# EasyEDA Pro project ProProject_消毒盒3.0_传统版_2023-10-16.epro

# Schematic 消毒盒3.0
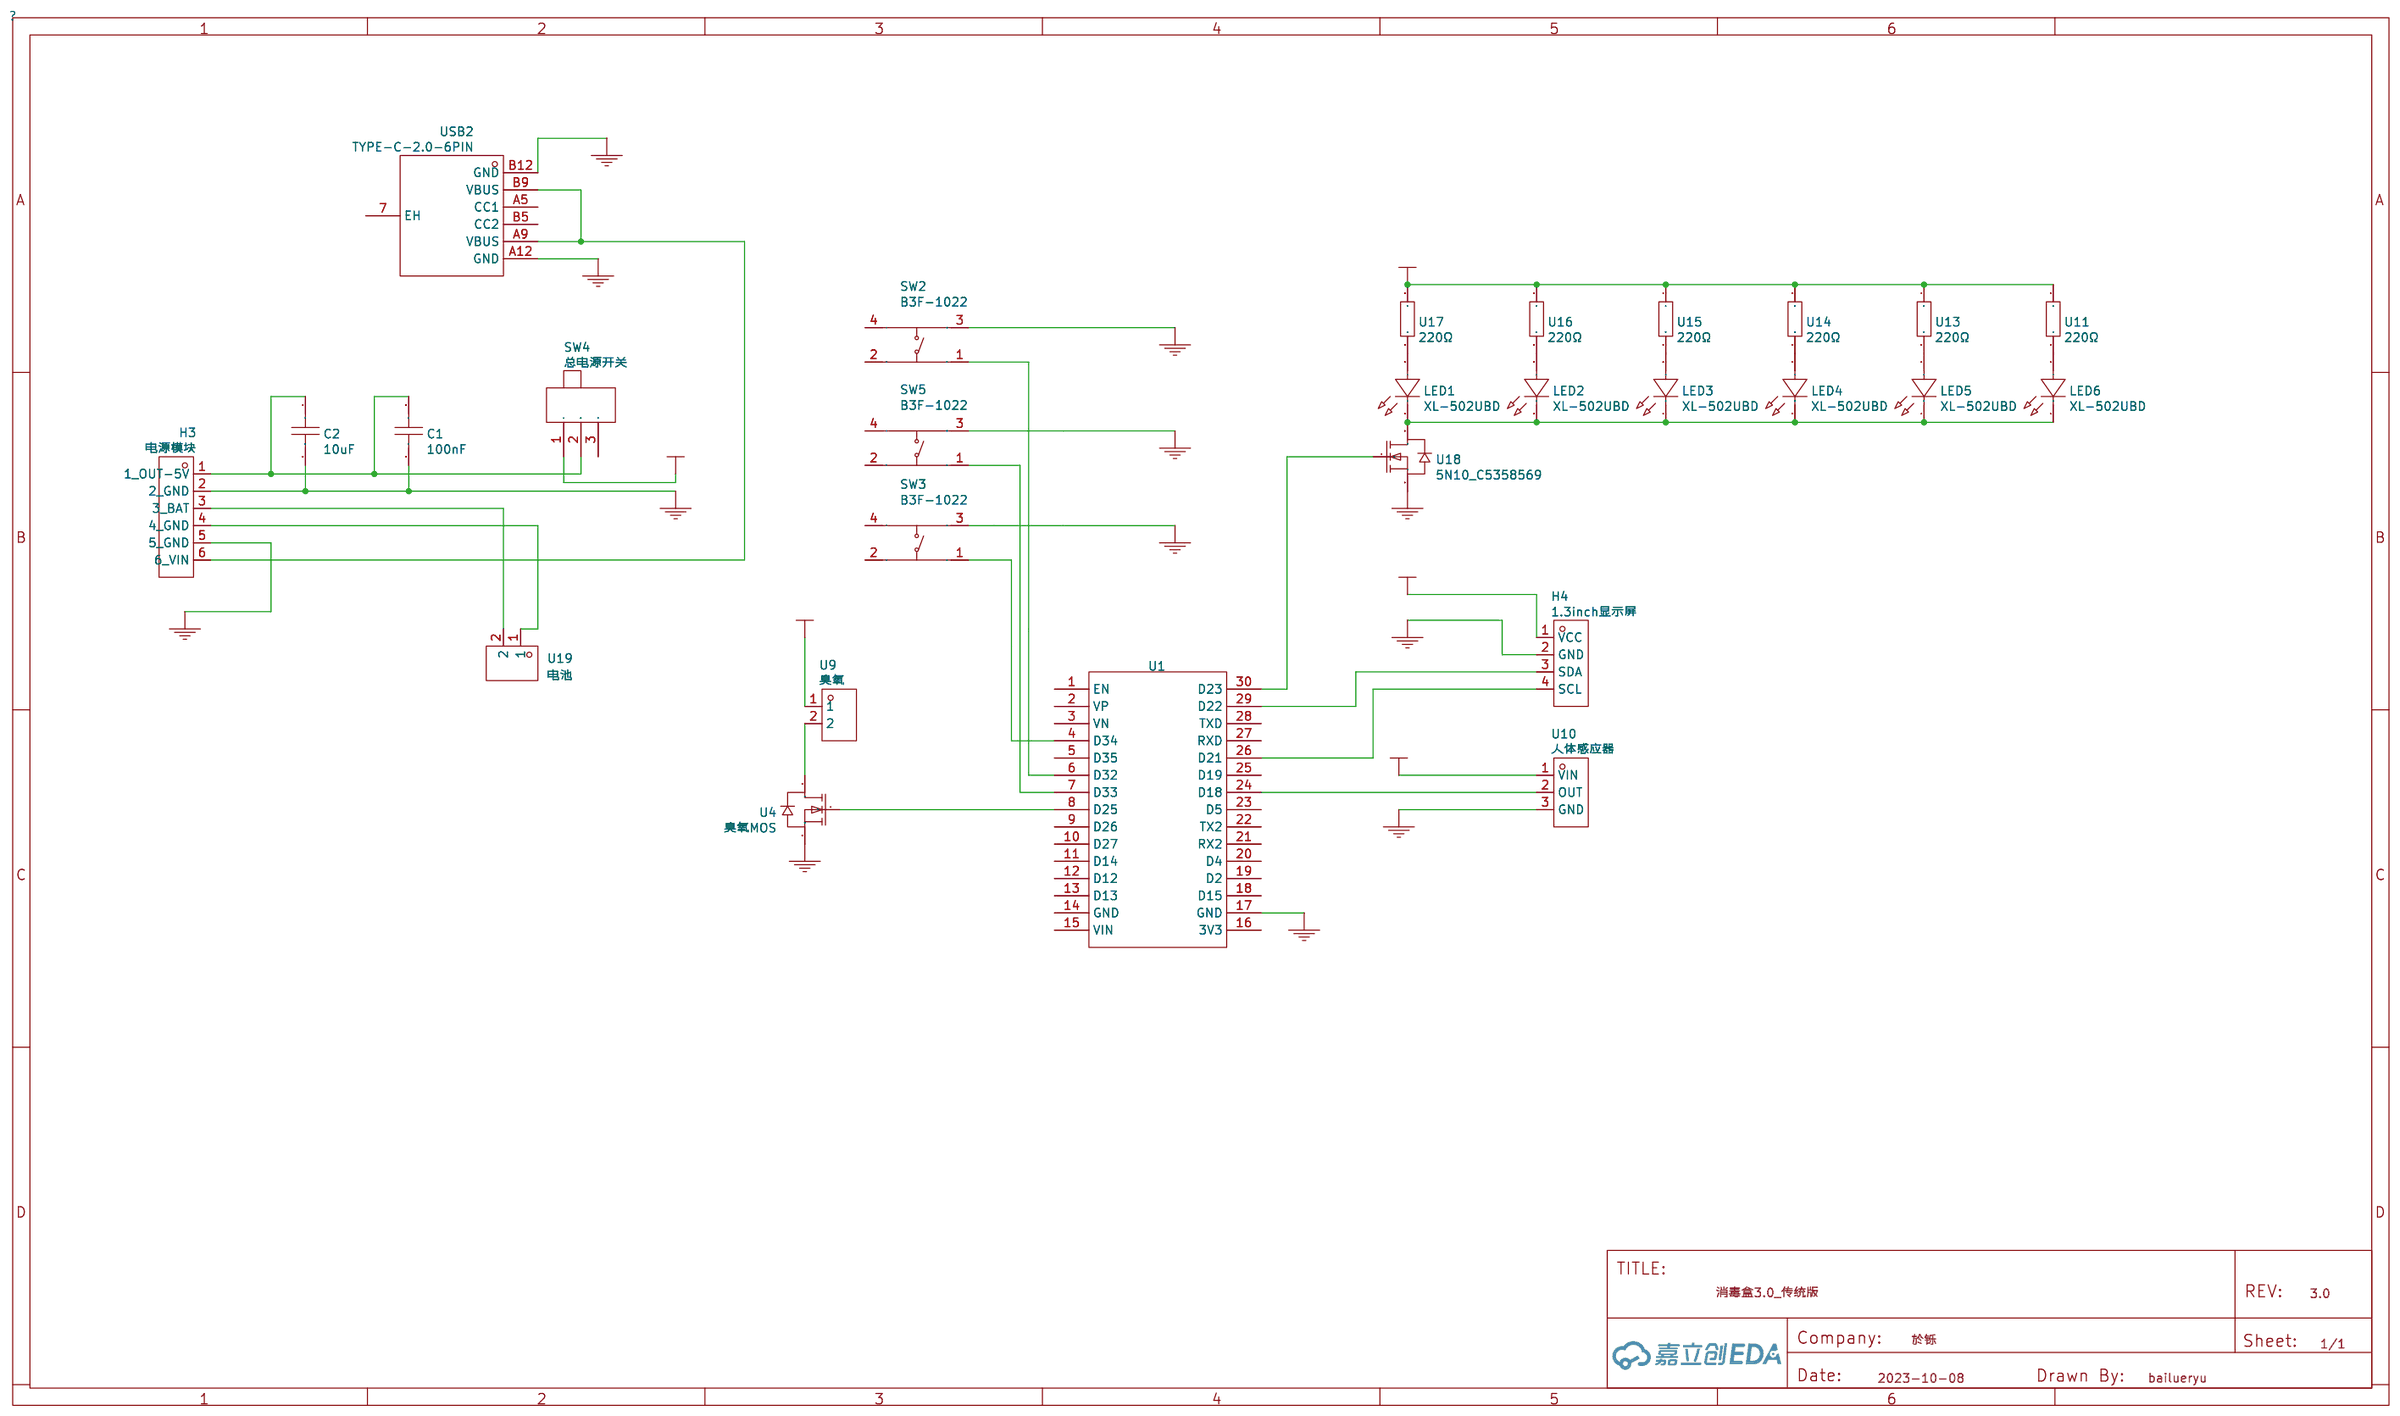
[diagram p0: schematic sheet]

## Parts
C1  100nF  [C0603]
C2  10uF  [C0603]
H3  电源模块  [HDR-TH_6P-P2.54-V-M]
H4  1.3inch显示屏  [HDR-TH_4P-P2.54-V-M]
LED1  XL-502UBD  [LED-TH_BD5.9-P2.54-RD_BLUE]
LED2  XL-502UBD  [LED-TH_BD5.9-P2.54-RD_BLUE]
LED3  XL-502UBD  [LED-TH_BD5.9-P2.54-RD_BLUE]
LED4  XL-502UBD  [LED-TH_BD5.9-P2.54-RD_BLUE]
LED5  XL-502UBD  [LED-TH_BD5.9-P2.54-RD_BLUE]
LED6  XL-502UBD  [LED-TH_BD5.9-P2.54-RD_BLUE]
SW2  B3F-1022  [SW-TH_4P-L6.0-W6.0-P4.50-LS6.5]
SW3  B3F-1022  [SW-TH_4P-L6.0-W6.0-P4.50-LS6.5]
SW4  总电源开关  [SW-TH_MK-12D18-G040]
SW5  B3F-1022  [SW-TH_4P-L6.0-W6.0-P4.50-LS6.5]
U1  NO  [ESP-WROOM-32]
U4  臭氧MOS  [SOT-23-3_L2.9-W1.3-P1.90-LS2.4-BR]
U9  臭氧  [HDR-TH_2P-P2.00-V-M]
U10  人体感应器  [HDR-TH_3P-P2.00-V-M]
U11  220Ω  [RES-TH_BD2.3-L3.7-P7.70-D0.9]
U13  220Ω  [RES-TH_BD2.3-L3.7-P7.70-D0.9]
U14  220Ω  [RES-TH_BD2.3-L3.7-P7.70-D0.9]
U15  220Ω  [RES-TH_BD2.3-L3.7-P7.70-D0.9]
U16  220Ω  [RES-TH_BD2.3-L3.7-P7.70-D0.9]
U17  220Ω  [RES-TH_BD2.3-L3.7-P7.70-D0.9]
U18  5N10_C5358569  [SOT-23-3_L2.9-W1.3-P1.90-LS2.4-BR]
U19  电池  [HDR-TH_2P-P2.00-V-M]
USB2  TYPE-C-2.0-6PIN  [TYPE-C-SMD_TYPE-C-6P-2]

## Library data of the parts
C1 = 100nF: link: https://so.szlcsc.com/global.html?k=C3152610&amp;ref=editor; 3DModel: C0603_L1.6-W0.8-H0.8; Supplier: LCSC; Supplier Part: C3152610; Manufacturer: Sunway(信维通信); Manufacturer Part: MC0603B104K500N8RH; JLCPCB Part Class: Extended Part
C2 = 10uF: link: https://so.szlcsc.com/global.html?k=C15415&amp;ref=editor; 3DModel: C0603_L1.6-W0.8-H0.8; Supplier: LCSC; Supplier Part: C15415; Manufacturer: SAMSUNG(三星); JLCPCB Part Class: Extended Part
H3 = 电源模块: link: https://so.szlcsc.com/global.html?k=C492405&amp;ref=editor; 3DModel: HDR-TH_6P-P2.54-M-LI-1X6P; Supplier: LCSC; Supplier Part: C492405; Manufacturer: XFCN(兴飞); Manufacturer Part: PZ254V-11-06P; JLCPCB Part Class: Extended Part
H4 = 1.3inch显示屏: link: https://so.szlcsc.com/global.html?k=C2905435&amp;ref=editor; 3DModel: HDR-TH_4P-P2.54-M-LI-1X4P; Supplier: LCSC; Supplier Part: C2905435; Manufacturer: kinghelm(金航标); Manufacturer Part: KH-2.54PH180-1X4P-L11.5; JLCPCB Part Class: Extended Part
LED1-LED6 = XL-502UBD: link: https://so.szlcsc.com/global.html?k=C2895496&amp;ref=editor; Supplier: LCSC; Supplier Part: C2895496; Manufacturer: XINGLIGHT(成兴光); JLCPCB Part Class: Extended Part
SW2 SW3 SW5 = B3F-1022: link: https://so.szlcsc.com/global.html?k=C231317&amp;ref=editor; 3DModel: SW-TH_4P-L6.0-W6.0-H5.0-LS6.5-P4.50; Supplier: LCSC; Supplier Part: C231317; Manufacturer: OMRON(欧姆龙); JLCPCB Part Class: Extended Part
SW4 = 总电源开关: link: https://so.szlcsc.com/global.html?k=C3019727&amp;ref=editor; Supplier: LCSC; Supplier Part: C3019727; Manufacturer: G-Switch(品赞); Manufacturer Part: MK-12D18-G020; JLCPCB Part Class: Extended Part
U1 = NO
U4 = 臭氧MOS: link: https://so.szlcsc.com/global.html?k=C5358569&amp;ref=editor; 3DModel: SOT-23-3P_L2.9-W1.3-H1.0-LS2.4-P0.95; Supplier: LCSC; Supplier Part: C5358569; Manufacturer: GOODWORK(固得沃克); Manufacturer Part: 5N10
U9 U19 = 臭氧: link: https://so.szlcsc.com/global.html?k=C18164974&amp;ref=editor; 3DModel: HDR-TH_2P-P2.00-M-LI-1X2P; Supplier: LCSC; Supplier Part: C18164974; Manufacturer: CONNFLY; Manufacturer Part: DS1025-01-1x2P8BV1-B
U10 = 人体感应器: link: https://so.szlcsc.com/global.html?k=C18164975&amp;ref=editor; 3DModel: HDR-TH_3P-P2.00-M-LI-1X3P; Supplier: LCSC; Supplier Part: C18164975; Manufacturer: CONNFLY; Manufacturer Part: DS1025-01-1x3P8BV1-B
U11 U13-U17 = 220Ω: link: https://so.szlcsc.com/global.html?k=C2848572&amp;ref=editor; 3DModel: RES-TH_BD2.3-L3.7-P7.62-D0.4; Supplier: LCSC; Supplier Part: C2848572; Manufacturer: VO(翔胜); Manufacturer Part: MF1/8W-220Ω±1%-ST52; JLCPCB Part Class: Extended Part
U18 = 5N10_C5358569: link: https://so.szlcsc.com/global.html?k=C5358569&amp;ref=editor; 3DModel: SOT-23-3P_L2.9-W1.3-H1.0-LS2.4-P0.95; Supplier: LCSC; Supplier Part: C5358569; Manufacturer: GOODWORK(固得沃克); Manufacturer Part: 5N10
USB2 = TYPE-C-2.0-6PIN: link: https://so.szlcsc.com/global.html?k=C2987385&amp;ref=editor; Supplier: LCSC; Supplier Part: C2987385; Manufacturer: CIKI(皓富); Manufacturer Part: Type-C-2.0-6Pin; JLCPCB Part Class: Extended Part

## Nets
GND: C1.1 C2.2 H3.2(2 GND) H3.5(5 GND) H4.2(GND) SW2.3 SW3.3 SW5.3 U1.17(GND) U4.2(S) U10.3(GND) U18.2(S) USB2.A12(GND) USB2.B12(GND)
VCC: H4.1(VCC) SW4.1 U9.1 U10.1(VIN) U11.1 U13.1 U14.1 U15.1 U16.1 U17.1
$1N112: U1.8(D25) U4.1(G)
$1N404: LED1.1(K) LED2.1(K) LED3.1(K) LED4.1(K) LED5.1(K) LED6.1(K) U18.3(D)
$1N605: U1.30(D23) U18.1(G)
$1N699: SW2.1 U1.6(D32)
$1N700: SW5.1 U1.7(D33)
$1N701: SW3.1 U1.4(D34)
Net-(C1-2): C1.2 C2.1 H3.1(1 OUT-5V) SW4.2
Net-(H3-3): H3.3(3 BAT) U19.2
Net-(H3-4): H3.4(4 GND) U19.1
Net-(H3-6): H3.6(6 VIN) USB2.A9(VBUS) USB2.B9(VBUS)
Net-(H4-3): H4.3(SDA) U1.29(D22)
Net-(H4-4): H4.4(SCL) U1.26(D21)
Net-(LED1-2): LED1.2(A) U17.2
Net-(LED2-2): LED2.2(A) U16.2
Net-(LED3-2): LED3.2(A) U15.2
Net-(LED4-2): LED4.2(A) U14.2
Net-(LED5-2): LED5.2(A) U13.2
Net-(LED6-2): LED6.2(A) U11.2
Net-(U1-24): U1.24(D18) U10.2(OUT)
Net-(U4-3): U4.3(D) U9.2

Not connected (* = marked no-connect by the designer): SW2 2 4; SW3 2 4; SW4 3; SW5 2 4; U1 1(EN) 2(VP) 3(VN) 5(D35) 9(D26) 10(D27) 11(D14) 12(D12) 13(D13) 14(GND) 15(VIN) 16(3V3) 18(D15) 19(D2) 20(D4) 21(RX2) 22(TX2) 23(D5) 25(D19) 27(RXD) 28(TXD); USB2 7(EH) A5(CC1) B5(CC2)

# Board PCB_PCB_消毒盒3.0_2023-10-11
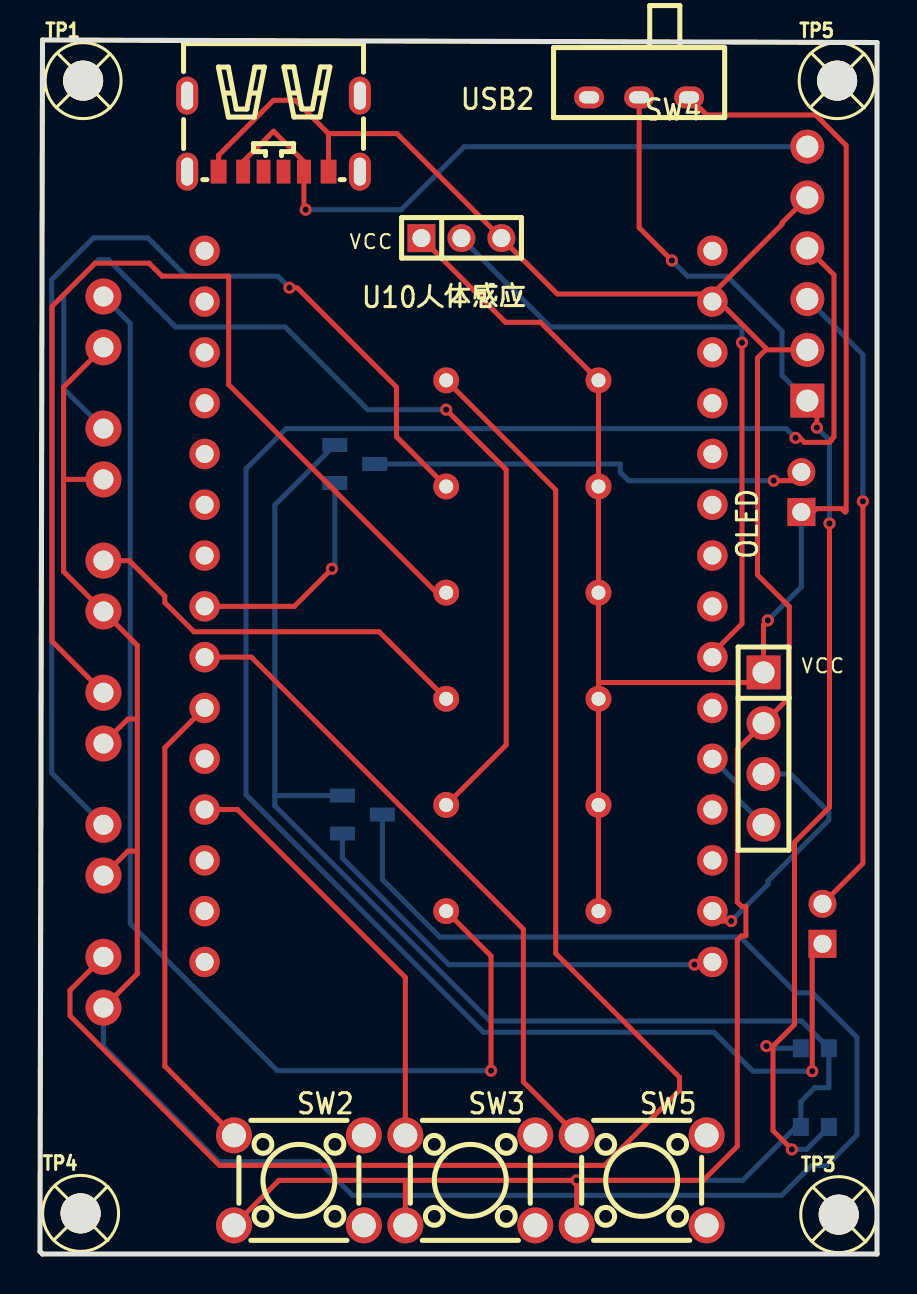
[diagram p1: board, top side]
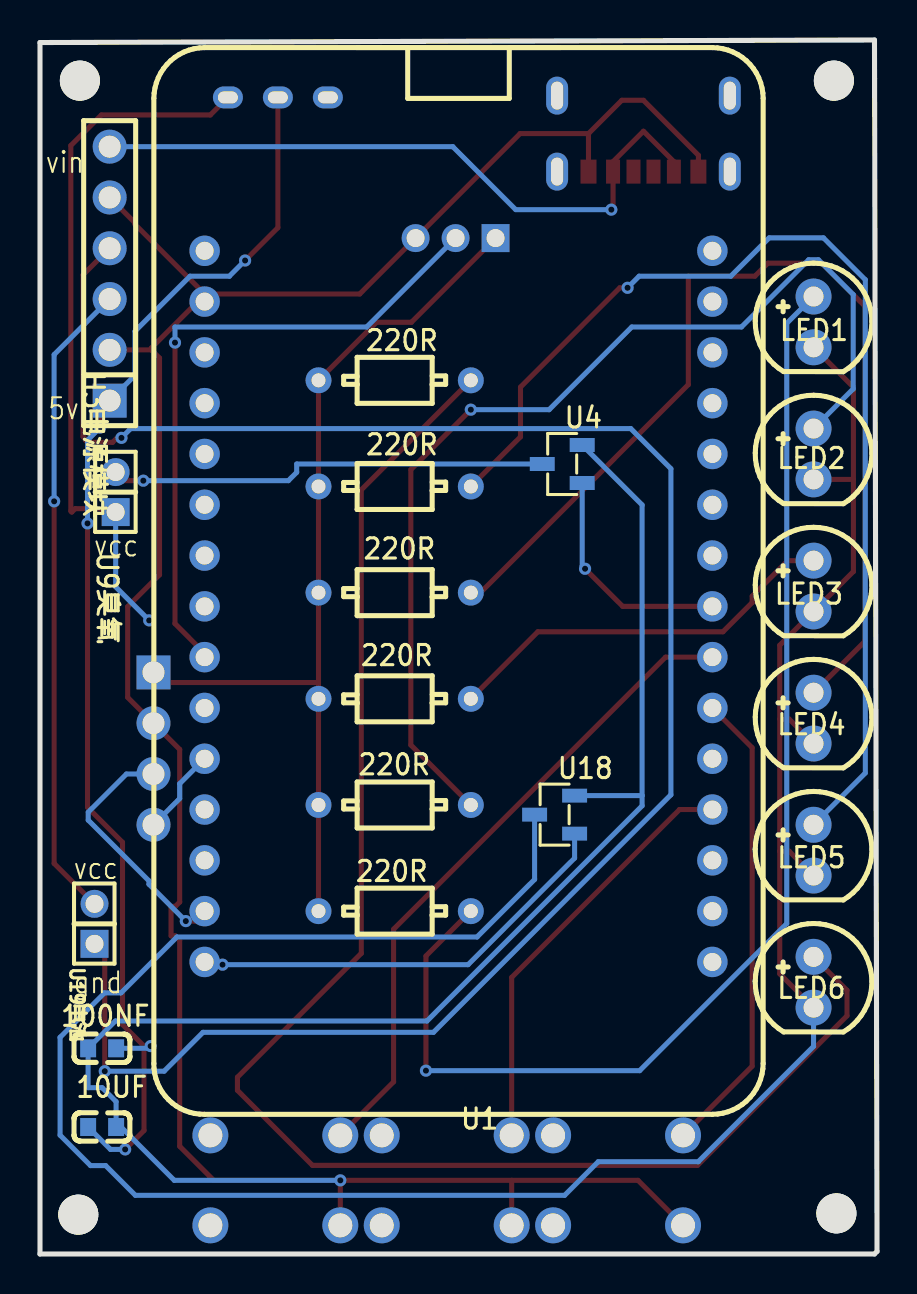
[diagram p2: board, bottom side, seen from below]

Outline 41.87 x 60.71 mm; copper layers: Top Layer, Bottom Layer. Coordinates in mm from the lower left corner of the outline.
Outline path: 0,0.13 0.12,58.77 0.13,60.71 41.87,60.58 41.87,0 0.13,0 0,0.13
Stack: Top Layer 0.035mm / Dielectric1 1.51mm FR4 er 4.5 / Bottom Layer 0.035mm

## Design rules (mm)
template: 用户自定义配置
spacing Default (default): track to track 0.152, other pairs 0 to 0.152
track width Default (default): min 0.254, default 0.254, max 25.4
differential pair differentialPair (default): width min 0.127, default 0.254, max 2.54; gap min 0.152, default 0.152
via Default (default): diameter min 0.61, default 0.61, max 100.025; hole min 0.305, default 0.305, max 59.995

## Placement (name value [footprint] x y rotation side)
10UF  10uF  [C0603]  38.76 6.35 180 bottom
100NF  100nF  [C0603]  38.76 10.29 180 bottom
220R  -  [RES-TH_BD2.3-L3.7-P7.70-D0.9]  24.13 43.69 180 bottom
220R#2  -  [RES-TH_BD2.3-L3.7-P7.70-D0.9]  24.13 38.38 180 bottom
220R#3  -  [RES-TH_BD2.3-L3.7-P7.70-D0.9]  24.13 33.07 180 bottom
220R#4  -  [RES-TH_BD2.3-L3.7-P7.70-D0.9]  24.13 27.76 180 bottom
220R#5  -  [RES-TH_BD2.3-L3.7-P7.70-D0.9]  24.13 22.45 180 bottom
220R#6  -  [RES-TH_BD2.3-L3.7-P7.70-D0.9]  24.13 17.14 180 bottom
H3电源模块  电源模块  [HDR-TH_6P-P2.54-V-M]  38.39 49.02 90 bottom
LED1  XL-502UBD  [LED-TH_BD5.9-P2.54-RD_BLUE]  3.17 46.61 90 bottom
LED2  XL-502UBD  [LED-TH_BD5.9-P2.54-RD_BLUE]  3.17 40 90 bottom
LED3  XL-502UBD  [LED-TH_BD5.9-P2.54-RD_BLUE]  3.17 33.4 90 bottom
LED4  XL-502UBD  [LED-TH_BD5.9-P2.54-RD_BLUE]  3.17 26.8 90 bottom
LED5  XL-502UBD  [LED-TH_BD5.9-P2.54-RD_BLUE]  3.17 20.19 90 bottom
LED6  XL-502UBD  [LED-TH_BD5.9-P2.54-RD_BLUE]  3.17 13.59 90 bottom
OLED  1.3inch显示屏  [HDR-TH_4P-P2.54-V-M]  36.19 25.27 270 top
SW2  B3F-1022  [SW-TH_4P-L6.0-W6.0-P4.50-LS6.5]  12.95 3.68 0 top
SW3  B3F-1022  [SW-TH_4P-L6.0-W6.0-P4.50-LS6.5]  21.53 3.68 0 top
SW4  总电源开关  [SW-TH_MK-12D18-G040]  29.97 57.83 180 top
SW5  B3F-1022  [SW-TH_4P-L6.0-W6.0-P4.50-LS6.5]  30.1 3.68 0 top
TP1  -  [M2螺丝]  2.16 58.67 0 top
TP3  -  [M2螺丝]  39.96 1.97 0 top
TP4  -  [M2螺丝]  2.03 2.03 0 top
TP5  -  [M2螺丝]  39.88 58.67 0 top
U1  NO  [ESP-WROOM-32]  8.24 14.6 0 bottom
U4  臭氧MOS  [SOT-23-3_L2.9-W1.3-P1.90-LS2.4-BR]  15.75 39.5 180 bottom
U9臭氧  臭氧  [HDR-TH_2P-P2.00-V-M]  38.09 38.1 90 bottom
U10人体感应  人体感应器  [HDR-TH_3P-P2.00-V-M]  21.08 50.8 0 top
U18  5N10_C5358569  [SOT-23-3_L2.9-W1.3-P1.90-LS2.4-BR]  16.13 21.97 180 bottom
U19电池  电池  [HDR-TH_2P-P2.00-V-M]  39.14 16.51 90 bottom
USB2  TYPE-C-2.0-6PIN  [TYPE-C-SMD_TYPE-C-6P-2]  11.68 56.02 180 top

## Footprints (pads in the part's own frame, mm; a bottom-side part is the same pattern mirrored in y, then rotated)
C0603
  rect 0.8x0.9 smd: 1(-0.7,0) 2(0.7,0)
ESP-WROOM-32
  round 1.524 hole 0.9: 1(0,0) 2(0,-2.54) 3(0,-5.08) 4(0,-7.62) 5(0,-10.16) 6(0,-12.7) 7(0,-15.24) 8(0,-17.78) 9(0,-20.32) 10(0,-22.86) 11(0,-25.4) 12(0,-27.94) 13(0,-30.48) 14(0,-33.02) 15(0,-35.56) 16(25.4,-35.56) 17(25.4,-33.02) 18(25.4,-30.48) 19(25.4,-27.94) 20(25.4,-25.4) 21(25.4,-22.86) 22(25.4,-20.32) 23(25.4,-17.78) 24(25.4,-15.24) 25(25.4,-12.7) 26(25.4,-10.16) 27(25.4,-7.62) 28(25.4,-5.08) 29(25.4,-2.54) 30(25.4,0)
HDR-TH_2P-P2.00-V-M
  rect 1.4x1.4 hole 0.9: 1(-1,0)
  round 1.4 hole 0.9: 2(1,0)
HDR-TH_3P-P2.00-V-M
  rect 1.4x1.4 hole 0.9: 1(-2,0)
  round 1.4 hole 0.9: 2(0,0) 3(2,0)
HDR-TH_4P-P2.54-V-M
  rect 1.7x1.7 hole 1.1: 1(-3.81,0)
  round 1.7 hole 1.1: 2(-1.27,0) 3(1.27,0) 4(3.81,0)
HDR-TH_6P-P2.54-V-M
  rect 1.7x1.7 hole 1.1: 1(-6.35,0)
  round 1.7 hole 1.1: 2(-3.81,0) 3(-1.27,0) 4(1.27,0) 5(3.81,0) 6(6.35,0)
LED-TH_BD5.9-P2.54-RD_BLUE
  round 1.8 hole 1: 1(-1.27,0) 2(1.27,0)
M2螺丝
  round 2 hole 2: 1(0,0)
RES-TH_BD2.3-L3.7-P7.70-D0.9
  round 1.3 hole 0.7: 1(-3.81,0) 2(3.81,0)
SOT-23-3_L2.9-W1.3-P1.90-LS2.4-BR
  rect 1.25x0.7 smd: 1(1,-0.95) 2(1,0.95) 3(-1,0)
SW-TH_4P-L6.0-W6.0-P4.50-LS6.5
  round 1.8 hole 1.2: 1(-3.25,2.25) 2(3.25,2.25) 3(-3.25,-2.25) 4(3.25,-2.25)
SW-TH_MK-12D18-G040
  oval 1.5x1.1 hole 1x0.6: 1(-2.5,0) 2(0,0) 3(2.5,0)
TYPE-C-SMD_TYPE-C-6P-2
  oval 1.1x1.9 hole 0.6x1.4: 7(-4.32,1.9) 8(4.32,1.9) 9(-4.32,-1.9) 10(4.32,-1.9)
  rect 0.7x1.2 smd: A5(-0.5,1.9) A9(1.52,1.9) B5(0.5,1.9) B9(-1.52,1.9)
  rect 0.8x1.2 smd: A12(2.75,1.9) B12(-2.75,1.9)

## Nets
GND: 10UF.2 100NF.1 H3电源模块.2 H3电源模块.5 OLED.2 SW2.3 SW3.3 SW5.3 U1.17 U4.2 U10人体感应.3 U18.2 USB2.A12 USB2.B12
VCC: 220R.1 220R#2.1 220R#3.1 220R#4.1 220R#5.1 220R#6.1 OLED.1 SW4.1 U9臭氧.1 U10人体感应.1
$1N52: U1.24 U10人体感应.2
$1N53: OLED.4 U1.26
$1N54: OLED.3 U1.29
$1N112: U1.8 U4.1
$1N216: U4.3 U9臭氧.2
$1N229: H3电源模块.6 USB2.A9 USB2.B9
$1N265: 10UF.1 100NF.2 H3电源模块.1 SW4.2
$1N269: H3电源模块.3 U19电池.2
$1N404: LED1.1 LED2.1 LED3.1 LED4.1 LED5.1 LED6.1 U18.3
$1N605: U1.30 U18.1
$1N699: SW2.1 U1.6
$1N700: SW5.1 U1.7
$1N701: SW3.1 U1.4
$1N710: 220R.2 LED6.2
$1N711: 220R#2.2 LED5.2
$1N712: 220R#3.2 LED4.2
$1N713: 220R#4.2 LED3.2
$1N714: 220R#5.2 LED2.2
$1N715: 220R#6.2 LED1.2
$1N1385: H3电源模块.4 U19电池.1

Pads without a net: SW2 2 4; SW3 2 4; SW4 3; SW5 2 4; TP1 1; TP3 1; TP4 1; TP5 1; U1 1 2 3 5 9 10 11 12 13 14 15 16 18 19 20 21 22 23 25 27 28; USB2 7 8 9 10 A5 B5

## Via types
v1: diameter 0.61, hole 0.305, Top Layer to Bottom Layer, 19 vias

## Routing (per net, layer and track width the routed paths; a pad name or vN(x,y) marks a point on that pad's centre or on a via; arc(x,y) is an arc through that point)
GND: length 191.9
  Top Layer w0.254: USB2.A12 8.93,54.94 11.68,57.69 12.77,57.69 14.43,56.02 ; H3电源模块.5 37.12,51.57 37.12,51.49 33.64,48.01 ; 14.43,56.02 USB2.B12 ; 14.43,56.02 17.86,56.02 U10人体感应.3 25.88,48.01 33.64,48.01 ; 18.28,3.68 SW3.3 ; 18.28,3.68 11.95,3.68 SW2.3 ; 18.28,3.68 v1(26.85,3.68) ; H3电源模块.2 36.3,45.21 ; 36.3,45.21 36.3,45.31 33.98,47.62 U1.17 33.64,48.01 ; 36.3,45.21 35.89,44.8 35.89,33.96 37.48,32.37 37.48,27.83 OLED.2 34.88,25.23 34.88,17.6 35.1,17.38 35.31,17.38 35.31,15.91 35.1,15.91 34.88,15.69 34.88,5.39 33.18,3.68 v1(26.85,3.68) ; v1(26.85,3.68) SW5.3
  Bottom Layer w0.254: 11.75,22.92 11.75,37.46 U4.2 ; 11.75,22.92 U18.2 ; 11.75,22.92 11.75,22.41 22.51,11.65 38.1,11.65 100NF.1 39.46,8.32 38.76,8.32 38.06,7.62 10UF.2 37.82,6.35 35.15,3.68 v1(26.85,3.68)
VCC: length 85.2
  Top Layer w0.254: 27.94,28.57 35.69,28.57 OLED.1 36.19,31.47 v1(36.41,31.68) ; 27.94,28.57 220R#3.1 220R#2.1 220R.1 25.04,46.59 23.29,46.59 U10人体感应.1 ; 27.94,28.57 220R#4.1 220R#5.1 220R#6.1 ; U9臭氧.1 38.67,37.1 38.84,37.27 40.11,37.27 40.28,37.1 40.33,37.15 40.33,55.43 38.8,56.96 33.35,56.96 SW4.1
  Bottom Layer w0.254: v1(36.41,31.68) 38.09,33.36 U9臭氧.1
$1N52: length 33
  Top Layer w0.254: 33.64,29.84 33.64,30.04 35.12,31.52 v1(35.12,45.57)
  Bottom Layer w0.254: v1(35.12,45.57) 35.12,46.35 25.53,46.35 U10人体感应.2
$1N53: length 4.4
  Bottom Layer w0.254: 33.64,24.77 34.88,23.52 34.88,22.77 OLED.4
$1N54: length 12.7
  Top Layer w0.254: U1.29 34.13,16.65 v1(34.58,16.65)
  Bottom Layer w0.254: OLED.3 37.55,24 39.46,22.09 39.46,21.7 36.42,18.66 36.42,18.49 v1(34.58,16.65)
$1N112: length 11.5
  Top Layer w0.254: U1.8 12.72,32.38 v1(14.61,34.27)
  Bottom Layer w0.254: U4.1 14.75,34.41 v1(14.61,34.27)
$1N216: length 22.1
  Top Layer w0.254: v1(36.7,38.67) 37.66,38.67 U9臭氧.2
  Bottom Layer w0.254: U4.3 29.03,39.5 29.03,39.09 29.45,38.67 v1(36.7,38.67)
$1N229: length 33.6
  Top Layer w0.254: USB2.A9 10.16,54.62 11.68,56.14 13.2,54.62 USB2.B9 13.2,52.31 v1(13.29,52.22)
  Bottom Layer w0.254: H3电源模块.6 21.22,55.37 18.07,52.22 v1(13.29,52.22)
$1N265: length 63.7
  Top Layer w0.254: SW4.2 29.97,51.32 v1(31.61,49.68) ; 36.67,10.4 37.74,11.47 37.74,20.59 39.5,22.34 v1(39.5,36.53) ; 36.67,10.4 v1(36.34,10.4) ; 36.67,10.4 36.67,6.17 v1(37.61,5.23) ; v1(38.86,41.32) 38.86,42.19 H3电源模块.1
  Bottom Layer w0.254: H3电源模块.1 37.12,43.94 37.12,46.14 34.37,48.89 32.4,48.89 v1(31.61,49.68) ; 10UF.1 38.34,5.23 v1(37.61,5.23) ; v1(36.34,10.4) 36.45,10.29 100NF.2 ; v1(39.5,36.53) 39.5,40.69 v1(38.86,41.32)
$1N269: length 32.2
  Top Layer w0.254: U19电池.2 41.16,19.53 v1(41.16,37.64)
  Bottom Layer w0.254: v1(41.16,37.64) 41.16,44.97 H3电源模块.3
$1N404: length 121.6
  Top Layer w0.254: 3.17,18.92 4.4,20.15 4.87,20.15 ; 4.87,26.75 4.4,26.75 LED4.1 ; 4.87,26.75 4.87,20.15 ; 4.87,26.75 4.87,30.44 LED3.1 1.18,34.12 1.18,38.73 ; 3.17,12.32 4.87,14.01 4.87,20.15 ; 1.18,38.73 LED2.1 ; 1.18,38.73 1.18,43.35 LED1.1
  Bottom Layer w0.254: 3.17,12.32 3.17,10.38 8.94,4.61 13.95,4.61 15.63,2.93 37.1,2.93 38.59,4.42 39.35,4.42 40.87,5.94 40.87,10.83 38.64,13.06 37.82,13.06 35.02,15.85 20.01,15.85 17.13,18.73 U18.3
$1N605: length 22
  Top Layer w0.254: v1(32.74,14.47) 32.88,14.6 U1.30
  Bottom Layer w0.254: U18.1 15.13,19.8 20.46,14.47 v1(32.74,14.47)
$1N699: length 23.6
  Top Layer w0.254: SW2.1 6.25,9.39 6.25,25.31 U1.6
$1N700: length 33
  Top Layer w0.254: SW5.1 26.85,5.94 24.18,8.61 24.18,16.24 10.58,29.84 8.24,29.84
$1N701: length 21.4
  Top Layer w0.254: SW3.1 18.28,13.83 9.88,22.22 U1.4
$1N710: length 79.1
  Top Layer w0.254: LED6.2 1.5,13.18 1.5,11.91 8.98,4.43 28.24,4.43 31.99,8.18 31.99,8.84 25.8,15.03 25.8,38.21 220R.2
$1N711: length 55.5
  Top Layer w0.254: v1(12.48,48.32) 12.87,48.32 17.83,43.35 17.83,40.86 220R#2.2
  Bottom Layer w0.254: LED5.2 0.59,24.05 0.59,48.72 2.68,50.81 5.39,50.81 7.31,48.89 11.9,48.89 v1(12.48,48.32)
$1N712: length 51
  Top Layer w0.254: LED4.2 0.61,30.64 0.61,47.39 2.76,49.54 5.46,49.54 6.11,48.89 9.44,48.89 9.44,43.47 19.84,33.07 220R#3.2
$1N713: length 20.2
  Top Layer w0.254: 220R#4.2 16.97,31.11 7.7,31.11 6.25,32.57 6.25,32.89 4.47,34.67 LED3.2
$1N714: length 52.7
  Top Layer w0.254: v1(20.32,42.22) 23.32,39.22 23.32,25.45 220R#5.2
  Bottom Layer w0.254: v1(20.32,42.22) 16.4,42.22 12.27,46.35 6.78,46.35 3.42,49.72 2.93,49.72 1.19,47.98 1.19,43.26 LED2.2
$1N715: length 61.9
  Top Layer w0.254: 220R#6.2 22.56,14.9 v1(22.56,9.17)
  Bottom Layer w0.254: v1(22.56,9.17) 11.87,9.17 4.52,16.52 4.52,46.54 LED1.2
$1N1385: length 97.6
  Top Layer w0.254: H3电源模块.4 39.72,48.96 39.72,40.87 39.6,40.75 39.6,40.7 39.49,40.59 38.24,40.59 38.01,40.81 v1(37.8,40.81) ; v1(38.63,9.14) 38.63,15 U19电池.1
  Bottom Layer w0.254: v1(38.63,9.14) 35.66,9.14 33.72,11.09 22.19,11.09 10.31,22.96 10.31,39.27 12.32,41.27 37.33,41.27 v1(37.8,40.81)

## Text on the board
Bottom Silkscreen Layer: vcc | gnd | 5v | vin
Top Silkscreen Layer: vcc
